# Altium schematic sheet Wireless.SchDoc
size A4; Revision: 0
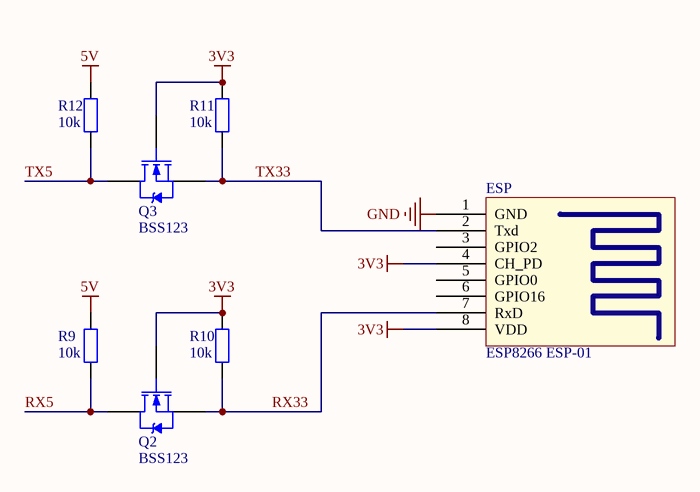
[diagram p0: Wireless.SchDoc]

## Parts
ESP  ESP8266 ESP-01  [ESP8266 ESP-01]
Q2  BSS123  [SOT23-3]
Q3  BSS123  [SOT23-3]
R9  10k  [0805-R]
R10  10k  [0805-R]
R11  10k  [0805-R]
R12  10k  [0805-R]

## Nets
3V3: ESP.4(CH_PD) ESP.8(VDD) Q2.1(G) Q3.1(G) R10.1 R11.1
5V: R9.1 R12.1
GND: ESP.1(GND)
RX5: Q2.3(D) R9.2
RX33: ESP.7(RxD) Q2.2(S) R10.2
TX5: Q3.3(D) R12.2
TX33: ESP.2(Txd) Q3.2(S) R11.2

Not connected (* = marked no-connect by the designer): ESP 3(GPIO2) 5(GPIO0) 6(GPIO16)

## Notes on the sheet
- Title
- Size:
- Date:
- A4
- Number:
- Time:
- Revision:
- Sheet
- of
- File:

## Library data of the parts
ESP = ESP8266 ESP-01: Embase PCB, Carte-à-carte, 2.54 mm, 2 Rangée(s), 8 Contact(s), Montage traversant, Série 2214S; Fabricant: MULTICOMP PRO; Fournisseur: Farnell; RefFabricant: 2214S-08SG-85; RefFournisseur: 1593489; Valeur: 2*4 cts
Q2 Q3 = 2N7000: MOSFET de puissance, Canal N, 100 V, 170 mA, 1.2 ohm, SOT-23, Montage en surface; Fabricant: ON SEMICONDUCTOR; Fournisseur: Farnell; RefFournisseur: 9845321; Voltage: 100V; RefFabricant: BSS123
R9-R12 = Res: Résistance à puce CMS, 10 kohm, ± 1%, 250 mW, 0805 [2012 Metric], Couche épaisse, Haute puissance; Fabricant: MULTICOMP PRO; Fournisseur: Farnell; RefFabricant: MCWF08P1002FTL; RefFournisseur: 2694096; Voltage: 150V; Revision: July-2002: Re-released for DXP Platform.; Valeur: 10k